# Altium project DMMSwitchBoard.PrjPcb
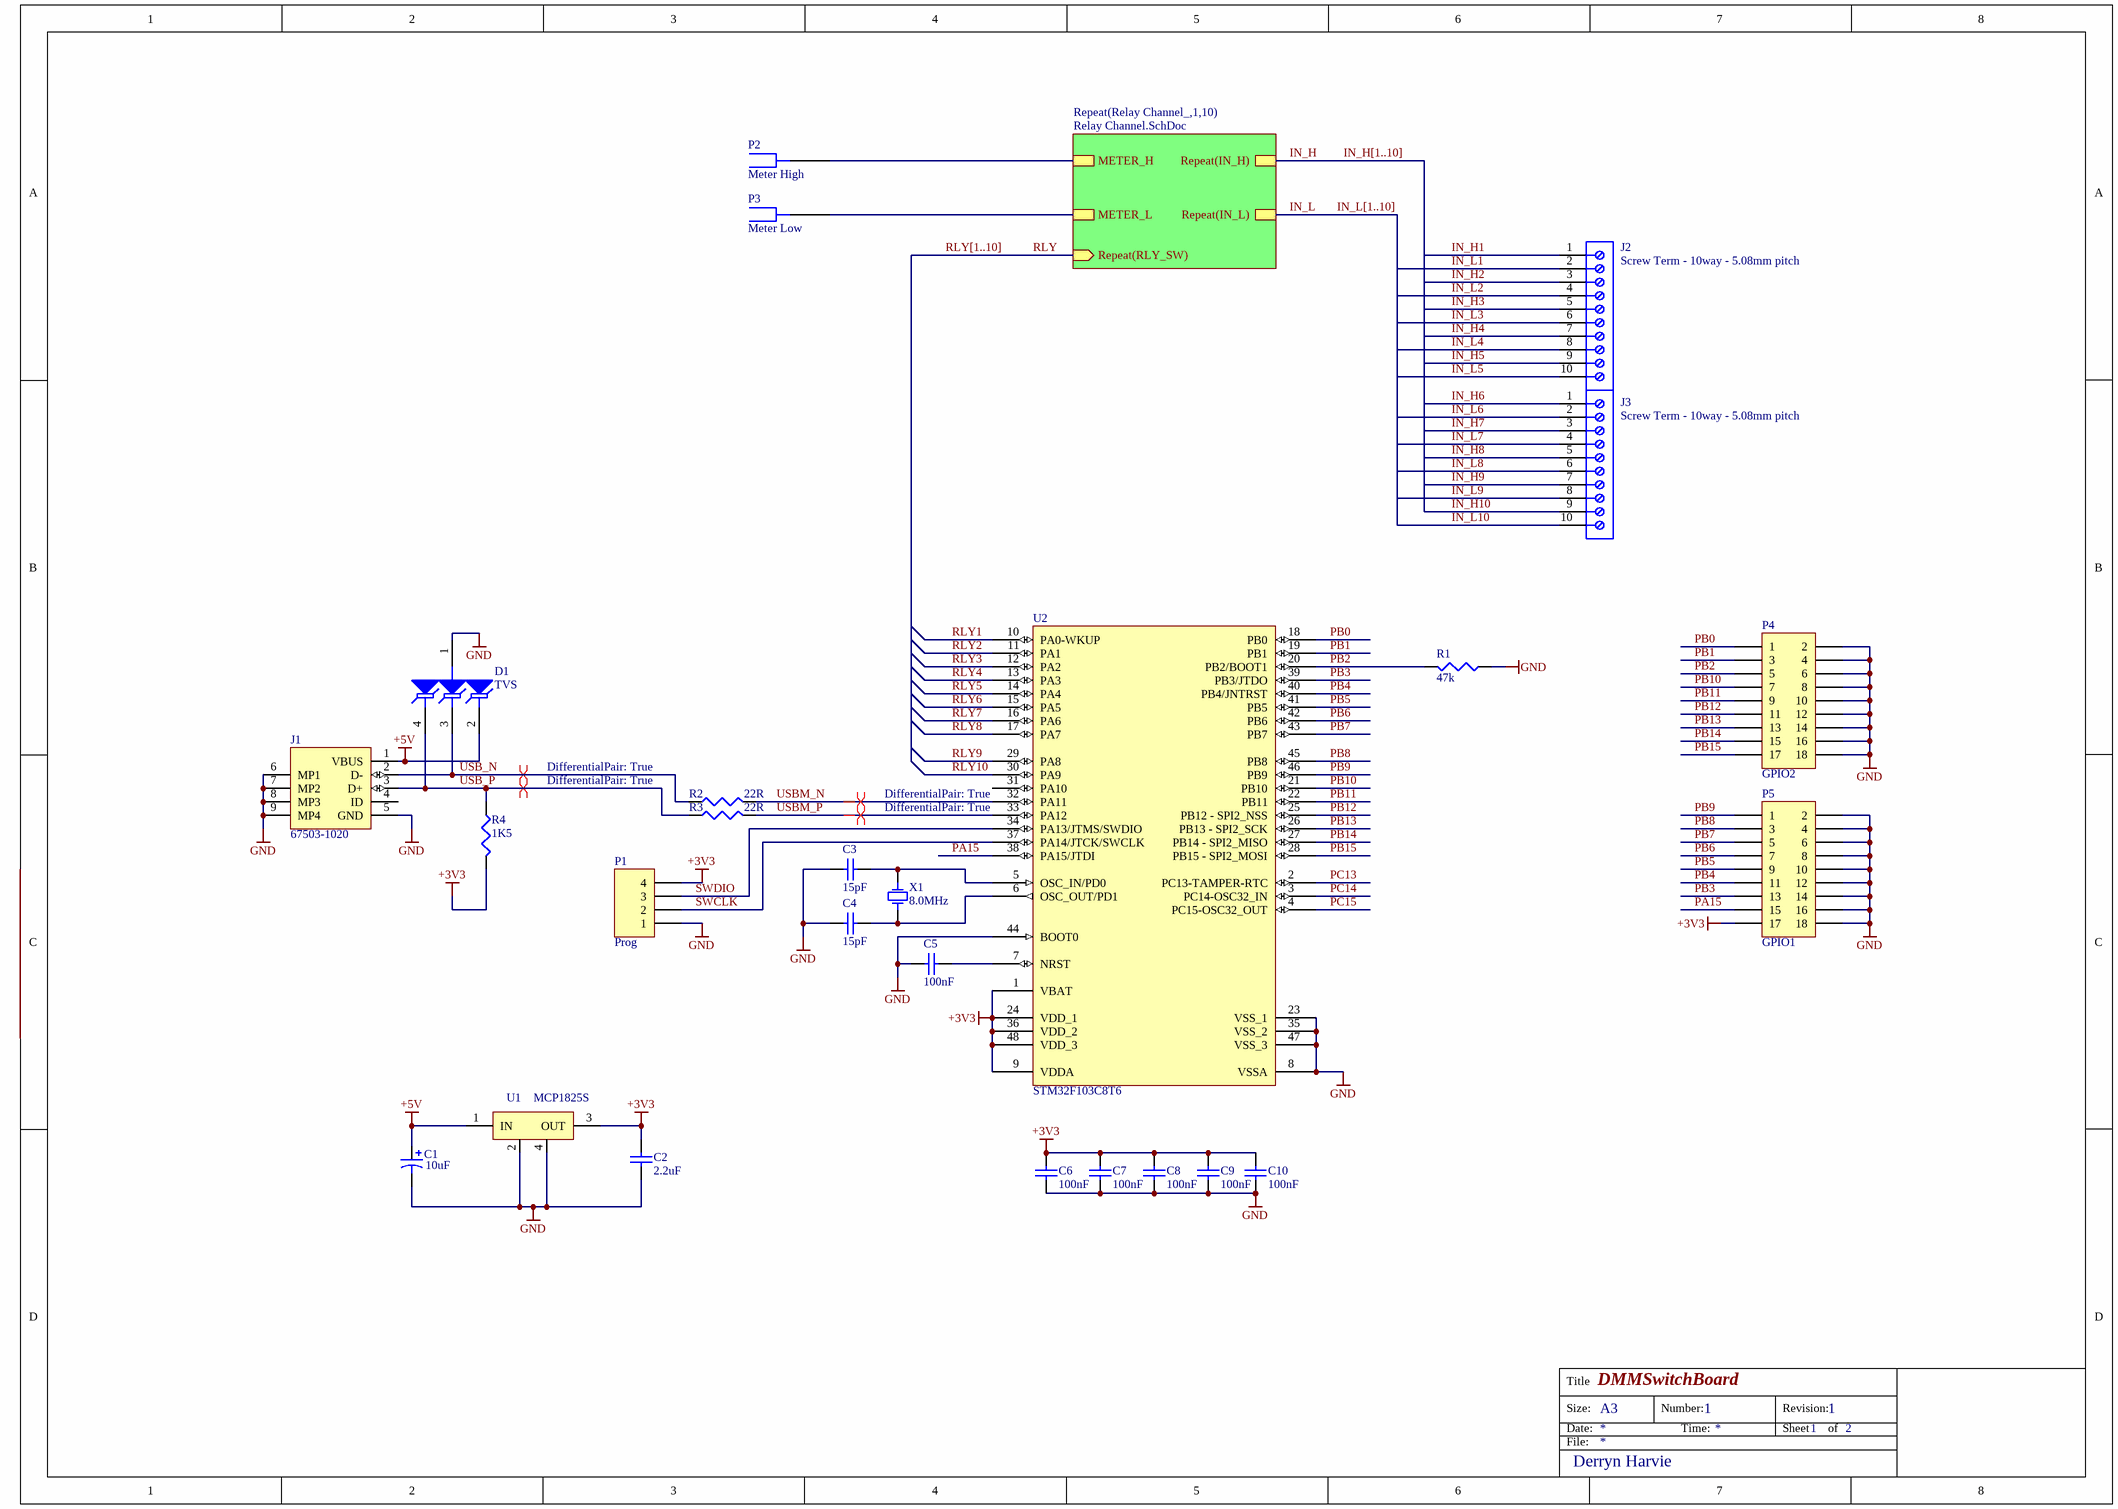
[diagram p0: DMMSwitchBoard.SchDoc]
2 sheets, 146 parts. Net scope: hierarchical (ports join the sheet entries above them; power ports are global).
Sheets:
  DMMSwitchBoard.SchDoc
    Relay Channel_1 = Relay Channel.SchDoc
    Relay Channel_2 = Relay Channel.SchDoc
    Relay Channel_3 = Relay Channel.SchDoc
    Relay Channel_4 = Relay Channel.SchDoc
    Relay Channel_5 = Relay Channel.SchDoc
    Relay Channel_6 = Relay Channel.SchDoc
    Relay Channel_7 = Relay Channel.SchDoc
    Relay Channel_8 = Relay Channel.SchDoc
    Relay Channel_9 = Relay Channel.SchDoc
    Relay Channel_10 = Relay Channel.SchDoc

## Sheet DMMSwitchBoard.SchDoc: DMMSwitchBoard
size A3; DocumentNumber: 1; Revision: 1; SheetNumber: 1; SheetTotal: 2; PageSetup: Record=PageOptions|CenterHorizontal=True|CenterVertical=True|PrintScale=0.71|XCorrection=1.00|YCorrection=1.00|PrintKind=0|BorderSize=5000000|LeftOffset=0|BottomOffset=0|Orientation=2|PaperLength=1000|PaperWidth=1000|Scale=100|PaperSource=7|PrintQuality=-3|MediaType=1|DitherType=10|PrintScaleMode=1|PaperKind=A4|PaperIndex=9

### Parts
C1  value 10uF  [0805]  (hidden comment: Cap Pol2)
C2  value 2.2uF  [0603]  (hidden comment: C0603)
C3  value 15pF  [0603]  (hidden comment: C0603)
C4  value 15pF  [0603]  (hidden comment: C0603)
C5  value 100nF  [0603]  (hidden comment: C0603)
C6  value 100nF  [0603]  (hidden comment: C0603)
C7  value 100nF  [0603]  (hidden comment: C0603)
C8  value 100nF  [0603]  (hidden comment: C0603)
C9  value 100nF  [0603]  (hidden comment: C0603)
C10  value 100nF  [0603]  (hidden comment: C0603)
D1  TVS  [SOT143-4]
J1  67503-1020  [MOLX-67503-1020_V]
J2  Screw Term - 10way - 5.08mm pitch  [ST-30W-5.08P]
J3  Screw Term - 10way - 5.08mm pitch  [ST-30W-5.08P]
P1  Prog  [HDR1X4]
P2  Meter High  [Banana_4mm_RA]
P3  Meter Low  [Banana_4mm_RA]
P4  GPIO2  [HDR2X9]
P5  GPIO1  [HDR2X9]
R1  value 47k  [0603]  (hidden comment: Resistor)
R2  value 22R  [0603]  (hidden comment: Resistor)
R3  value 22R  [0603]  (hidden comment: Resistor)
R4  value 1K5  [0603]  (hidden comment: Resistor)
U1  MCP1825S  [SOT223]
U2  STM32F103C8T6  [LQFP48_L]
X1  8.0MHz  [8MHz Crystal]

### Sub-sheets
Repeat(Relay Channel_,1,10) = Relay Channel.SchDoc: Repeat(RLY_SW) (in), METER_H, METER_L, Repeat(IN_L), Repeat(IN_H)

### Nets
+3V3: C2.1 C6.1 C7.1 C8.1 C9.1 C10.1 P1.4 P5.17 R4.2 U1.3(OUT) U2.1(VBAT) U2.9(VDDA) U2.24(VDD_1) U2.36(VDD_2) U2.48(VDD_3)
+5V: C1.1 D1.2 J1.1(VBUS) U1.1(IN)
GND: C1.2 C2.2 C3.1 C4.1 C5.1 C6.2 C7.2 C8.2 C9.2 C10.2 D1.1 J1.5(GND) J1.6(MP1) J1.7(MP2) J1.8(MP3) J1.9(MP4) P1.1 P4.2 P4.4 P4.6 P4.8 P4.10 P4.12 P4.14 P4.16 P4.18 P5.2 P5.4 P5.6 P5.8 P5.10 P5.12 P5.14 P5.16 P5.18 R1.1 U1.2(GND@1) U1.4(GND@2) U2.8(VSSA) U2.23(VSS_1) U2.35(VSS_2) U2.44(BOOT0) U2.47(VSS_3)
IN_H: sheet Repeat(Relay Channel_,1,10)/Repeat(IN_H)
IN_H1: J2.1
IN_H2: J2.3
IN_H3: J2.5
IN_H4: J2.7
IN_H5: J2.9
IN_H6: J3.1
IN_H7: J3.3
IN_H8: J3.5
IN_H9: J3.7
IN_H10: J3.9
IN_L: sheet Repeat(Relay Channel_,1,10)/Repeat(IN_L)
IN_L1: J2.2
IN_L2: J2.4
IN_L3: J2.6
IN_L4: J2.8
IN_L5: J2.10
IN_L6: J3.2
IN_L7: J3.4
IN_L8: J3.6
IN_L9: J3.8
IN_L10: J3.10
PA15: P5.15 U2.38(PA15/JTDI)
PB0: P4.1 U2.18(PB0)
PB1: P4.3 U2.19(PB1)
PB2: P4.5 R1.2 U2.20(PB2/BOOT1)
PB3: P5.13 U2.39(PB3/JTDO)
PB4: P5.11 U2.40(PB4/JNTRST)
PB5: P5.9 U2.41(PB5)
PB6: P5.7 U2.42(PB6)
PB7: P5.5 U2.43(PB7)
PB8: P5.3 U2.45(PB8)
PB9: P5.1 U2.46(PB9)
PB10: P4.7 U2.21(PB10)
PB11: P4.9 U2.22(PB11)
PB12: P4.11 U2.25(PB12_-_SPI2_NSS)
PB13: P4.13 U2.26(PB13_-_SPI2_SCK)
PB14: P4.15 U2.27(PB14_-_SPI2_MISO)
PB15: P4.17 U2.28(PB15_-_SPI2_MOSI)
PC13: U2.2(PC13-TAMPER-RTC)
PC14: U2.3(PC14-OSC32_IN)
PC15: U2.4(PC15-OSC32_OUT)
RLY: sheet Repeat(Relay Channel_,1,10)/Repeat(RLY_SW)
RLY1: U2.10(PA0-WKUP)
RLY2: U2.11(PA1)
RLY3: U2.12(PA2)
RLY4: U2.13(PA3)
RLY5: U2.14(PA4)
RLY6: U2.15(PA5)
RLY7: U2.16(PA6)
RLY8: U2.17(PA7)
RLY9: U2.29(PA8)
RLY10: U2.30(PA9)
SWCLK: P1.2 U2.37(PA14/JTCK/SWCLK)
SWDIO: P1.3 U2.34(PA13/JTMS/SWDIO)
USB_N: D1.3 J1.2(D-) R2.1
USB_P: D1.4 J1.3(D+) R3.1 R4.1
USBM_N: R2.2 U2.32(PA11)
USBM_P: R3.2 U2.33(PA12)
NetC3_2: C3.2 U2.5(OSC_IN/PD0) X1.2
NetC4_2: C4.2 U2.6(OSC_OUT/PD1) X1.1
NetC5_2: C5.2 U2.7(NRST)
NetP2_1: P2.1 ; sheet Repeat(Relay Channel_,1,10)/METER_H
NetP3_1: P3.1 ; sheet Repeat(Relay Channel_,1,10)/METER_L

Not connected (* = marked no-connect by the designer): J1 4(ID); U2 31(PA10)

### Buses and harness runs
bus IN_H[1..10]
bus IN_L[1..10]
bus RLY[1..10]

### Layout directives
differential pair: USB_N, USB_P, USBM_N, USBM_P

### Notes on the sheet
- Title
- Size:
- Date:
- File:
- A3
- Number:
- Time:
- Revision:
- Sheet
- of
- Derryn Harvie

### Library data of the parts
C1 = Tantalum Capacitor: Surface Mount Tantalum Capacitor
C2-C10 = C0603: Ceramic Chip Capacitor - Standard; Note: Footprint corresponds to dimensions for bulk cassette packaging. This case size has tightened tolerances.; Published: 17-Jul-2002; PackageReference: 0603; Publisher: Altium Limited; Code_JEITA: 0603; Code_IPC: 1608 [0603]
D1 = TVS Array - SP0503BAHTG: TVS Array USB; Supplier 1: Octopart; Supplier Part Number 1: Digi-Key - F2715TR-ND
J1 = CMP-0411-00002-1: USB, MINI, SMD, RA KME04-USBMU03A01; Manufacturer: Molex; ComponentLink1URL: http://www.molex.com/; PartNumber: 67503-1020; Mounting Technology: Surface Mount; ComponentLink1Description: Manufacturer URL; Terminal Pitch: 0.8 mm; DatasheetVersion: Rev F, 06/2009; ComponentLink2Description: Datasheet; PackageDescription: Mini USB Connector, SMT, Righer Angle; ComponentLink2URL: http://www.molex.com/pdm_docs/sd/675031020_sd.pdf; PackageReference: 67503-1020
J2 J3 = Screw Term - 10way - 5.08mm pitch: Terminal Block, Pitch 5.08mm, 10 Way
P1 = Header 4: Header, 4-Pin; LatestRevisionDate: 17-Jul-2002; LatestRevisionNote: Re-released for DXP Platform.; Publisher: Altium Limited
P2 P3 = Jack - Banana - Right Angle: Banana Jack 4mm Right Angle
P4 P5 = Header 9X2: Header, 9-Pin, Dual row; LatestRevisionDate: 17-Jul-2002; LatestRevisionNote: Re-released for DXP Platform.; Publisher: Altium Limited
U1 = MCP1825S-3302E/DB: IC REG LDO 3.3V 0.5A SOT223-3; Manufacturer: Microchip Technology; Regulator Topology: Positive Fixed; Current - Output: 500mA; Voltage - Dropout (Typical): 0.21V @ 500mA; Number of Regulators: 1; Voltage - Input: Up to 6V; Supplier 1: Digi-Key; Manufacturer Part Number: MCP1825S-3302E/DB; RoHS: RoHS Compliant; Category: Integrated Circuits (ICs); Stock 1: 6354; Pricing 1: 1=0.71, 25=0.5948, 100=0.5394 (AUD); Packaging: Tube; Voltage - Output: 3.3V; Current - Limit (Min): -; Operating Temperature: -40°C ~ 125°C; Mounting Type: Surface Mount; Package / Case: TO-261-4, TO-261AA; Supplier Device Package: SOT-223-3; ComponentLink1URL: http://www.microchip.com/mymicrochip/filehandler.aspx?ddocname=en531698; ComponentLink1Description: http://www.microchip.com/mymicrochip/filehandler.aspx?ddocname=en531698; Supplier Part Number 1: MCP1825S-3302E/DB-ND
U2 = STM32F103C8T6: STM32 ARM-based 32-bit MCU with 64 Kbytes Flash, 48-pin LQFP, Industrial Temperature; Manufacturer: STMicroelectronics; Data RAM Size: 20 kB; Data RAM Type: SRAM; Interface Type: CAN, I2C, SPI, USART, USB; Number of I/Os: 48 I/O; Program Memory Size: 64 kB; ADC Resolution: 12 bit; Core: ARM Cortex M3; Data Bus Width: 32 bit; Maximum Clock Frequency: 72 MHz; Number of ADC Channels: 10; Number of Timers/Counters: 3 Timer; Operating Supply Voltage: 2 V to 3.6 V; Processor Series: ARM Cortex-M; Supply Voltage - Max: 3.6 V; Supply Voltage - Min: 2 V; Supplier 1: Mouser; Manufacturer Part Number: STM32F103C8T6; RoHS: RoHS Compliant; Category: ARM Microcontrollers - MCU; Stock 1: 1663; Pricing 1: 1=6.04, 10=5.14, 25=5.05, 100=4.45, 250=4.22, 500=3.76, 1000=3.18, 2500=2.94 (USD); Package / Case: LQFP-48; Packaging: Tray; Product: MCU; Program Memory Type: Flash; Series: STM32F1; Brand: STMicroelectronics; Mounting Style: SMD/SMT; Maximum Operating Temperature: + 85 C; Minimum Operating Temperature: - 40 C; Standard Pack Qty: 1500; Tradename: STM32; RoHS - Mouser: Y; Minimum Order Quantity: 1; Reeling: False; ComponentLink3URL: http://www.mouser.com/ds/2/389/CD00161566-315155.pdf; ComponentLink3Description: http://www.mouser.com/ds/2/389/CD00161566-315155.pdf; Supplier Part Number 1: 511-STM32F103C8T6
X1 = ABL-8.000MHZ-B2.: ABRACON - ABL-8.000MHZ-B2. - CRYSTAL, 8MHZ, 18PF, HC-49US; Supplier 1: Farnell; Manufacturer: ABRACON; Manufacturer Part Number: ABL-8.000MHZ-B2.; RoHS: YES; Stock 1: 40; Pricing 1: 1=0.632, 10=0.562, 50=0.46, 100=0.41, 500=0.37, 1000=0.345 (AUD); ComponentLink1URL: http://www.farnell.com/datasheets/1359171.pdf; ComponentLink1Description: http://www.farnell.com/datasheets/1359171.pdf; Supplier Part Number 1: 7940397

## Sheet Relay Channel.SchDoc: DMMSwitchBoard - Relay Channel
size A4; DocumentNumber: 2; Revision: 1; SheetNumber: 2; SheetTotal: 2; PageSetup: Record=PageOptions|CenterHorizontal=True|CenterVertical=True|PrintScale=0.97|XCorrection=1.00|YCorrection=1.00|PrintKind=0|BorderSize=5000000|LeftOffset=0|BottomOffset=0|Orientation=2|PaperLength=1000|PaperWidth=1000|Scale=100|PaperSource=7|PrintQuality=-3|MediaType=1|DitherType=10|PrintScaleMode=1|PaperKind=A4|PaperIndex=9
Used 10 times, as channels Relay Channel_1, Relay Channel_2, Relay Channel_3, Relay Channel_4, Relay Channel_5, Relay Channel_6, Relay Channel_7, Relay Channel_8, Relay Channel_9, Relay Channel_10. Parts and nets are listed once, with the designators drawn on the sheet.
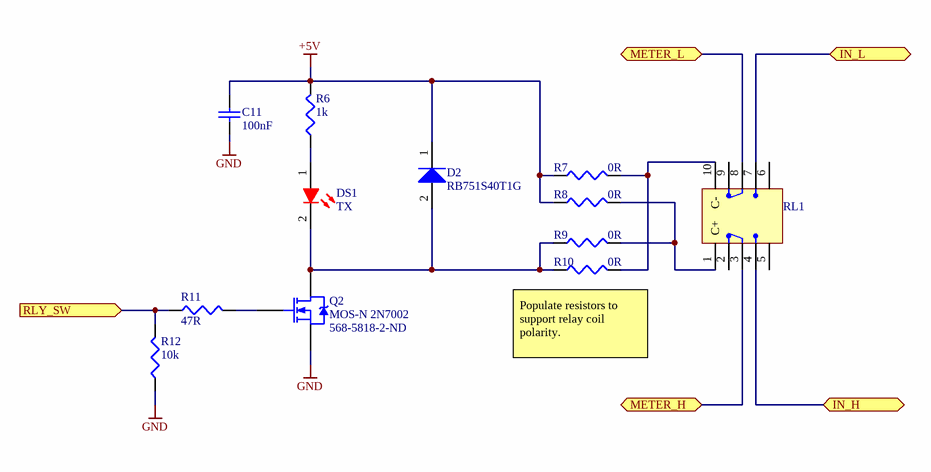
[diagram p1: Relay Channel.SchDoc]

### Parts
C11  value 100nF  [0603]  (hidden comment: C0603)
D2  RB751S40T1G  [ONSC-SOD-523-2-502-01_C_V]
DS1  TX  [TOSH-0603LED_RED_V]
Q2  MOS-N 2N7002  Supplier Part Number 1: 568-5818-2-ND  [SOT-23B_N]
R6  value 1k  [0603]  (hidden comment: Resistor)
R7  value 0R  [0603]  (hidden comment: Resistor)
R8  value 0R  [0603]  (hidden comment: Resistor)
R9  value 0R  [0603]  (hidden comment: Resistor)
R10  value 0R  [0603]  (hidden comment: Resistor)
R11  value 47R  [0603]  (hidden comment: Resistor)
R12  value 10k  [0603]  (hidden comment: Resistor)
RL1  Relay - PS-5  [PS-5 Relay]  (value not drawn)

### Ports
IN_H, IN_L, METER_H, METER_L, RLY_SW (in)

### Nets
+5V: C11.2 D2.1(K) R6.2 R7.1 R8.1
GND: C11.1 Q2.2(S) R12.1
IN_H: RL1.4 ; port IN_H
IN_L: RL1.7 ; port IN_L
METER_H: RL1.3 ; port METER_H
METER_L: RL1.8 ; port METER_L
RLY_SW: R11.1 R12.2 ; port RLY_SW
NetD2_2: D2.2(A) DS1.2(K) Q2.3(D) R9.1 R10.1
NetDS1_1: DS1.1(A) R6.1
NetQ2_1: Q2.1(G) R11.2
NetR7_2: R7.2 R10.2 RL1.10(C-)
NetR8_2: R8.2 R9.2 RL1.1(C+)

Not connected (* = marked no-connect by the designer): RL1 2 5 6 9

### Channels
Relay Channel_1: designators end in _$ChannelName#1; ports IN_H=IN_H1 IN_L=IN_L1 METER_H=NetP2_1 METER_L=NetP3_1 RLY_SW=RLY1
Relay Channel_2: designators end in _$ChannelName#2; ports IN_H=IN_H2 IN_L=IN_L2 METER_H=NetP2_1 METER_L=NetP3_1 RLY_SW=RLY2
Relay Channel_3: designators end in _$ChannelName#3; ports IN_H=IN_H3 IN_L=IN_L3 METER_H=NetP2_1 METER_L=NetP3_1 RLY_SW=RLY3
Relay Channel_4: designators end in _$ChannelName#4; ports IN_H=IN_H4 IN_L=IN_L4 METER_H=NetP2_1 METER_L=NetP3_1 RLY_SW=RLY4
Relay Channel_5: designators end in _$ChannelName#5; ports IN_H=IN_H5 IN_L=IN_L5 METER_H=NetP2_1 METER_L=NetP3_1 RLY_SW=RLY5
Relay Channel_6: designators end in _$ChannelName#6; ports IN_H=IN_H6 IN_L=IN_L6 METER_H=NetP2_1 METER_L=NetP3_1 RLY_SW=RLY6
Relay Channel_7: designators end in _$ChannelName#7; ports IN_H=IN_H7 IN_L=IN_L7 METER_H=NetP2_1 METER_L=NetP3_1 RLY_SW=RLY7
Relay Channel_8: designators end in _$ChannelName#8; ports IN_H=IN_H8 IN_L=IN_L8 METER_H=NetP2_1 METER_L=NetP3_1 RLY_SW=RLY8
Relay Channel_9: designators end in _$ChannelName#9; ports IN_H=IN_H9 IN_L=IN_L9 METER_H=NetP2_1 METER_L=NetP3_1 RLY_SW=RLY9
Relay Channel_10: designators end in _$ChannelName#10; ports IN_H=IN_H10 IN_L=IN_L10 METER_H=NetP2_1 METER_L=NetP3_1 RLY_SW=RLY10

### Notes on the sheet
- (near R10) Populate resistors to support relay coil polarity.
- Title
- Size:
- Date:
- File:
- A4
- Number:
- Time:
- Revision:
- Sheet
- of
- Derryn Harvie

### Library data of the parts
C11 = C0603: as C2 on sheet DMMSwitchBoard; Published: 17-Jul-2002; PackageReference: 0603; Publisher: Altium Limited; Code_JEITA: 0603; Code_IPC: 1608 [0603]
D2 = CMP-1055-00474-1: Schottky Barrier Diode, 2-Pin SOD-523, Pb-Free, Tape and Reel; Manufacturer: On Semiconductor; Configuration: Single; IFSM Max (A): 0.5; ComponentLink1Description: Manufacturer URL; Packing: Tape and Reel; Mounting Technology: Surface Mount; RoHS: TRUE; PackageDescription: 2-Pin SOD, Body 1.2 x 0.8 mm; PartNumber: RB751S40T1G; ComponentLink2Description: Datasheet; PackageVersion: Rev. C, 03/2007; DatasheetVersion: Rev. 4; PackageReference: SOD-523-2-502-01_C; ComponentLink1URL: http://www.onsemi.com/; ComponentLink3Description: Package Specification; ComponentLink2URL: http://www.onsemi.cn/pub_link/Collateral/RB751S40T1-D.PDF; ComponentLink3URL: http://www.onsemi.cn/pub_link/Collateral/ESD5B5.0ST1G.PDF
DS1 = CMP-0444-00001-1: LED, Red 0603 (1608) 63mCd; Manufacturer: Toshiba; PartNumber: TLSU1008A(T04); Forward Current: 25 mA; Power Dissipation: 60 mW; Packing Type: Reel; Reverse Voltage: 4 V; Mounting Technology: Surface Mount; PackageDescription: 2-Pin SMT LED, 1.6 x 0.8 mm Pitch; ComponentLink1URL: http://www.toshiba-components.com/; ComponentLink1Description: Manufacturer URL; PackageReference: 0603LED_RED; ComponentLink2URL: http://www.semicon.toshiba.co.jp/info/docget.jsp?type=datasheet&lang=en&pid=TLSU1008A(T04); ComponentLink2Description: Datasheet; DatasheetVersion: Aug-08; Storage Temperature: -40 to 100 degC
Q2 = MOS-N 2N7002: N-MOSFET 2N7002 NXP; Published: 8-Jun-2000; LatestRevisionDate: 17-Jul-2002; LatestRevisionNote: Re-released for DXP Platform.; DatasheetVersion: PD-9.814; PackageVersion: Feb-1997; PackageReference: SOT23; Publisher: Altium Limited; PackageDescription: TO, Thru-Hole, Vertical, Heatsink Mounted; 3 In-Line Leads; Pitch 2.54 mm; ComponentLink1Description: Manufacturer Link; ComponentLink1URL: http://www.irf.com/; Supplier 1: Digi-Key
RL1 = Relay - PS-5: Relay Small Signal

## Nets that join several sheets
+5V: DMMSwitchBoard (C1.1 D1.2 J1.1 U1.1), Relay Channel_1 (5 pins), Relay Channel_2 (5 pins), Relay Channel_3 (5 pins), Relay Channel_4 (5 pins), Relay Channel_5 (5 pins), Relay Channel_6 (5 pins), Relay Channel_7 (5 pins), Relay Channel_8 (5 pins), Relay Channel_9 (5 pins), Relay Channel_10 (5 pins)
GND: DMMSwitchBoard (43 pins), Relay Channel_1 (C11_$ChannelName#1.1 Q2_$ChannelName#1.2 R12_$ChannelName#1.1), Relay Channel_2 (C11_$ChannelName#2.1 Q2_$ChannelName#2.2 R12_$ChannelName#2.1), Relay Channel_3 (C11_$ChannelName#3.1 Q2_$ChannelName#3.2 R12_$ChannelName#3.1), Relay Channel_4 (C11_$ChannelName#4.1 Q2_$ChannelName#4.2 R12_$ChannelName#4.1), Relay Channel_5 (C11_$ChannelName#5.1 Q2_$ChannelName#5.2 R12_$ChannelName#5.1), Relay Channel_6 (C11_$ChannelName#6.1 Q2_$ChannelName#6.2 R12_$ChannelName#6.1), Relay Channel_7 (C11_$ChannelName#7.1 Q2_$ChannelName#7.2 R12_$ChannelName#7.1), Relay Channel_8 (C11_$ChannelName#8.1 Q2_$ChannelName#8.2 R12_$ChannelName#8.1), Relay Channel_9 (C11_$ChannelName#9.1 Q2_$ChannelName#9.2 R12_$ChannelName#9.1), Relay Channel_10 (C11_$ChannelName#10.1 Q2_$ChannelName#10.2 R12_$ChannelName#10.1)
IN_H1: DMMSwitchBoard (J2.1), Relay Channel_1 (RL1_$ChannelName#1.4)
IN_H2: DMMSwitchBoard (J2.3), Relay Channel_2 (RL1_$ChannelName#2.4)
IN_H3: DMMSwitchBoard (J2.5), Relay Channel_3 (RL1_$ChannelName#3.4)
IN_H4: DMMSwitchBoard (J2.7), Relay Channel_4 (RL1_$ChannelName#4.4)
IN_H5: DMMSwitchBoard (J2.9), Relay Channel_5 (RL1_$ChannelName#5.4)
IN_H6: DMMSwitchBoard (J3.1), Relay Channel_6 (RL1_$ChannelName#6.4)
IN_H7: DMMSwitchBoard (J3.3), Relay Channel_7 (RL1_$ChannelName#7.4)
IN_H8: DMMSwitchBoard (J3.5), Relay Channel_8 (RL1_$ChannelName#8.4)
IN_H9: DMMSwitchBoard (J3.7), Relay Channel_9 (RL1_$ChannelName#9.4)
IN_H10: DMMSwitchBoard (J3.9), Relay Channel_10 (RL1_$ChannelName#10.4)
IN_L1: DMMSwitchBoard (J2.2), Relay Channel_1 (RL1_$ChannelName#1.7)
IN_L2: DMMSwitchBoard (J2.4), Relay Channel_2 (RL1_$ChannelName#2.7)
IN_L3: DMMSwitchBoard (J2.6), Relay Channel_3 (RL1_$ChannelName#3.7)
IN_L4: DMMSwitchBoard (J2.8), Relay Channel_4 (RL1_$ChannelName#4.7)
IN_L5: DMMSwitchBoard (J2.10), Relay Channel_5 (RL1_$ChannelName#5.7)
IN_L6: DMMSwitchBoard (J3.2), Relay Channel_6 (RL1_$ChannelName#6.7)
IN_L7: DMMSwitchBoard (J3.4), Relay Channel_7 (RL1_$ChannelName#7.7)
IN_L8: DMMSwitchBoard (J3.6), Relay Channel_8 (RL1_$ChannelName#8.7)
IN_L9: DMMSwitchBoard (J3.8), Relay Channel_9 (RL1_$ChannelName#9.7)
IN_L10: DMMSwitchBoard (J3.10), Relay Channel_10 (RL1_$ChannelName#10.7)
NetP2_1: DMMSwitchBoard (P2.1), Relay Channel_1 (RL1_$ChannelName#1.3), Relay Channel_2 (RL1_$ChannelName#2.3), Relay Channel_3 (RL1_$ChannelName#3.3), Relay Channel_4 (RL1_$ChannelName#4.3), Relay Channel_5 (RL1_$ChannelName#5.3), Relay Channel_6 (RL1_$ChannelName#6.3), Relay Channel_7 (RL1_$ChannelName#7.3), Relay Channel_8 (RL1_$ChannelName#8.3), Relay Channel_9 (RL1_$ChannelName#9.3), Relay Channel_10 (RL1_$ChannelName#10.3)
NetP3_1: DMMSwitchBoard (P3.1), Relay Channel_1 (RL1_$ChannelName#1.8), Relay Channel_2 (RL1_$ChannelName#2.8), Relay Channel_3 (RL1_$ChannelName#3.8), Relay Channel_4 (RL1_$ChannelName#4.8), Relay Channel_5 (RL1_$ChannelName#5.8), Relay Channel_6 (RL1_$ChannelName#6.8), Relay Channel_7 (RL1_$ChannelName#7.8), Relay Channel_8 (RL1_$ChannelName#8.8), Relay Channel_9 (RL1_$ChannelName#9.8), Relay Channel_10 (RL1_$ChannelName#10.8)
RLY1: DMMSwitchBoard (U2.10), Relay Channel_1 (R11_$ChannelName#1.1 R12_$ChannelName#1.2)
RLY2: DMMSwitchBoard (U2.11), Relay Channel_2 (R11_$ChannelName#2.1 R12_$ChannelName#2.2)
RLY3: DMMSwitchBoard (U2.12), Relay Channel_3 (R11_$ChannelName#3.1 R12_$ChannelName#3.2)
RLY4: DMMSwitchBoard (U2.13), Relay Channel_4 (R11_$ChannelName#4.1 R12_$ChannelName#4.2)
RLY5: DMMSwitchBoard (U2.14), Relay Channel_5 (R11_$ChannelName#5.1 R12_$ChannelName#5.2)
RLY6: DMMSwitchBoard (U2.15), Relay Channel_6 (R11_$ChannelName#6.1 R12_$ChannelName#6.2)
RLY7: DMMSwitchBoard (U2.16), Relay Channel_7 (R11_$ChannelName#7.1 R12_$ChannelName#7.2)
RLY8: DMMSwitchBoard (U2.17), Relay Channel_8 (R11_$ChannelName#8.1 R12_$ChannelName#8.2)
RLY9: DMMSwitchBoard (U2.29), Relay Channel_9 (R11_$ChannelName#9.1 R12_$ChannelName#9.2)
RLY10: DMMSwitchBoard (U2.30), Relay Channel_10 (R11_$ChannelName#10.1 R12_$ChannelName#10.2)

## Assembly variants
RelayPol1: not fitted R6 R8
RelayPol2: not fitted R7 R9